# Altium schematic sheet Buttons.SchDoc
size A; SheetNumber: 2; SheetTotal: 4
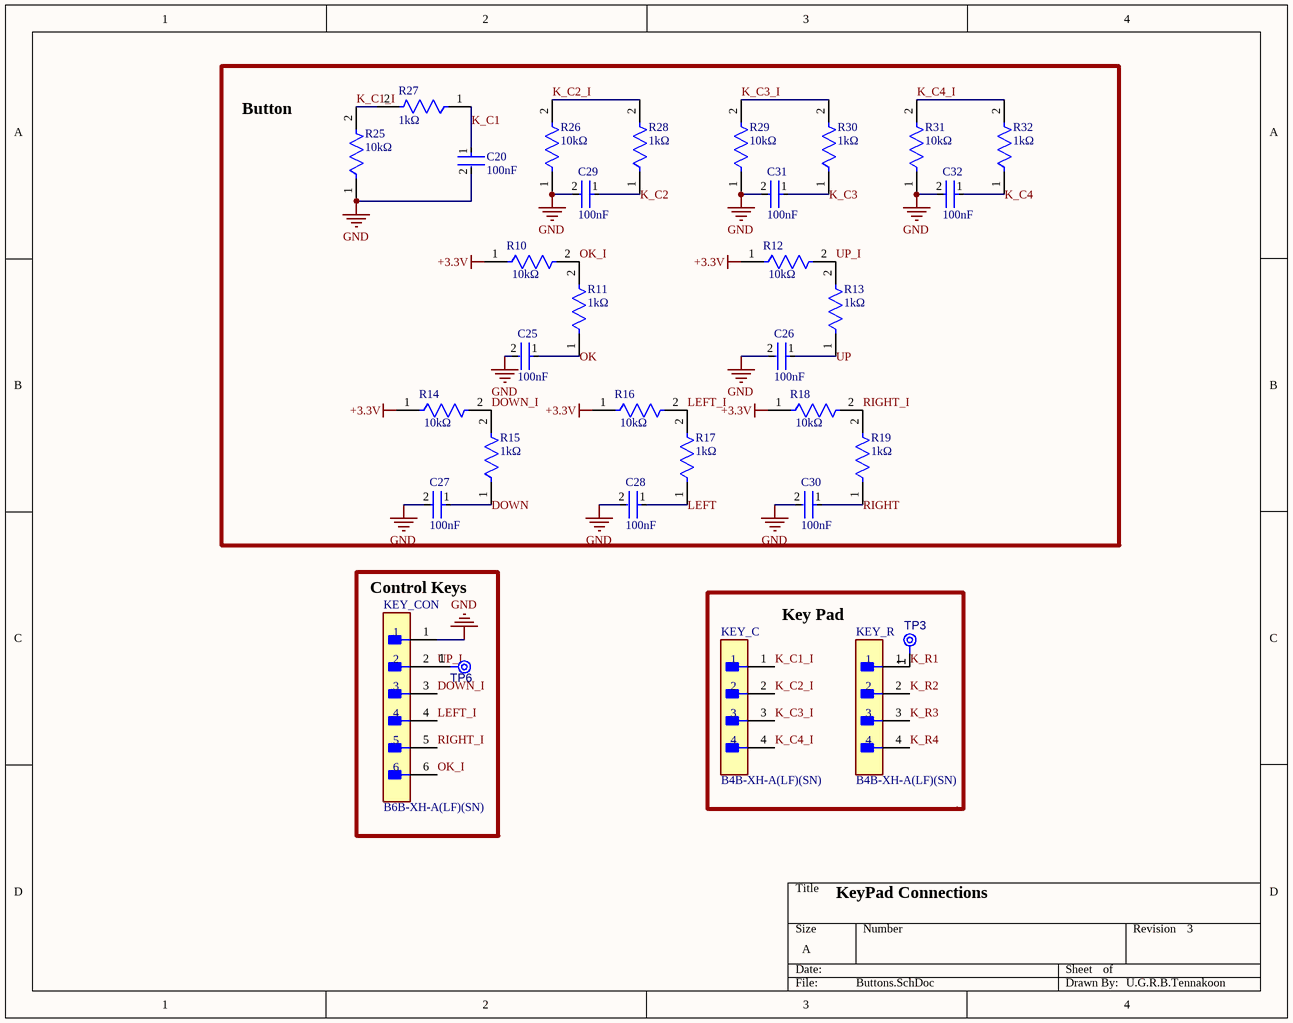
[diagram p0: Buttons.SchDoc]

## Parts
C20  100nF  [FP-CL21-IPC_A]
C25  100nF  [FP-CL21-IPC_A]
C26  100nF  [FP-CL21-IPC_A]
C27  100nF  [FP-CL21-IPC_A]
C28  100nF  [FP-CL21-IPC_A]
C29  100nF  [FP-CL21-IPC_A]
C30  100nF  [FP-CL21-IPC_A]
C31  100nF  [FP-CL21-IPC_A]
C32  100nF  [FP-CL21-IPC_A]
KEY_C  B4B-XH-A(LF)(SN)  [FP-B4B-XH-A_LF_SN-MFG]  (no BOM)
KEY_CON  B6B-XH-A(LF)(SN)  [FP-B6B-XH-A_LF_SN-MFG]  (no BOM)
KEY_R  B4B-XH-A(LF)(SN)  [FP-B4B-XH-A_LF_SN-MFG]  (no BOM)
R10  10kΩ  [FP-SR0805-MFG]
R11  1kΩ  [FP-SR0805-MFG]
R12  10kΩ  [FP-SR0805-MFG]
R13  1kΩ  [FP-SR0805-MFG]
R14  10kΩ  [FP-SR0805-MFG]
R15  1kΩ  [FP-SR0805-MFG]
R16  10kΩ  [FP-SR0805-MFG]
R17  1kΩ  [FP-SR0805-MFG]
R18  10kΩ  [FP-SR0805-MFG]
R19  1kΩ  [FP-SR0805-MFG]
R25  10kΩ  [FP-SR0805-MFG]
R26  10kΩ  [FP-SR0805-MFG]
R27  1kΩ  [FP-SR0805-MFG]
R28  1kΩ  [FP-SR0805-MFG]
R29  10kΩ  [FP-SR0805-MFG]
R30  1kΩ  [FP-SR0805-MFG]
R31  10kΩ  [FP-SR0805-MFG]
R32  1kΩ  [FP-SR0805-MFG]
TP3  TPAD6R  [TP06R]  (value not drawn)  (no BOM)
TP6  TPAD6R  [TP06R]  (value not drawn)  (no BOM)

## Nets
+3.3V: R10.1 R12.1 R14.1 R16.1 R18.1
GND: C20.2 C25.2 C26.2 C27.2 C28.2 C29.2 C30.2 C31.2 C32.2 KEY_CON.1 R25.1 R26.1 R29.1 R31.1
DOWN: C27.1 R15.1
DOWN_I: KEY_CON.3 R14.2 R15.2
K_C1: C20.1 R27.1
K_C1_I: KEY_C.1 R25.2 R27.2
K_C2: C29.1 R28.1
K_C2_I: KEY_C.2 R26.2 R28.2
K_C3: C31.1 R30.1
K_C3_I: KEY_C.3 R29.2 R30.2
K_C4: C32.1 R32.1
K_C4_I: KEY_C.4 R31.2 R32.2
K_R1: KEY_R.1 TP3.1(TP)
K_R2: KEY_R.2
K_R3: KEY_R.3
K_R4: KEY_R.4
LEFT: C28.1 R17.1
LEFT_I: KEY_CON.4 R16.2 R17.2
OK: C25.1 R11.1
OK_I: KEY_CON.6 R10.2 R11.2
RIGHT: C30.1 R19.1
RIGHT_I: KEY_CON.5 R18.2 R19.2
UP: C26.1 R13.1
UP_I: KEY_CON.2 R12.2 R13.2 TP6.1(TP)

## Notes on the sheet
- (near R25) Button
- (near KEY_CON) Control Keys
- Key Pad
- KeyPad Connections
- 3
- U.G.R.B.Tennakoon

## Library data of the parts
C20 C25-C32 = CMP-13271-000177-1: CL21B104KCFWPNE CL21 Series 0805 100nF 100V ±10% Tolerance X7R Multilayer Ceramic Chip Capacitor; Thickness: 0.053inch; Features: Soft Termination; Width: 0.049inch; Min Operating Temperature: -55°C; Ratings: AEC-Q200; Case Code (Imperial): 0805; Mount: Surface Mount; Packaging: Tape and Reel; Case/Package: 0805; Length: 0.079inch; Voltage Rating: 100V; Capacitance: 100nF; Case Code (Metric): 2012; Tolerance: 10%; Max Operating Temperature: 125°C
KEY_C KEY_R = CMP-17439-000250-1: CONN HEADER VERT 4POS 2.5MM; Number of Contacts: 4; Contact Resistance: 20mR; Voltage Rating: 250V; Max Current Rating: 3A; Gender: Male; Wire/Cable Gauge: 22AWG; Mated Stacking Heights: 9.8mm; Insulation Resistance: 1GR; Orientation: Straight; Contact Type: Male Pin; Contact Finish - Mating: TIN; Series: XH; Max Voltage Rating (AC): 250V; Lead Pitch: 2.5mm; Contact Shape: Square; Insulation Color: Natural; Termination: Solder; Lead Free: Lead Free; Voltage Rating (AC): 250V; Number of Rows: 1; Flammability Rating: UL94 V-0; Number of Positions: 4; Max Operating Temperature: 85°C; Package Quantity: 500; Mount: Through Hole; REACH SVHC: No SVHC; Connector Type: Header; Insulation Material: Nylon; Fastening Type: Detent; Min Operating Temperature: -25°C; Housing Color: White; Packaging: Bulk; Contact Plating: Tin; Contact Material: Brass; Max Voltage Rating (DC): 250V; Housing Material: Polyamide; Color: Natural; Material: Polyamide; Pitch: 2.5mm; Depth: 5.75mm; Current Rating: 3A; Length: 12.4mm
KEY_CON = CMP-17439-000076-1: CONN HEADER VERT 6POS 2.5MM
R10 R12 R14 R16 R18 R25 R26 R29 R31 = CMP-03412-005404-1: RES SMD 0805 1/2W 1% 10K OHM; Manufacturer Part Number: SR0805FR-4710KL; Manufacturer: Yageo; Power Rating: 0.5W; Voltage Rating: 150V; Tolerance: 0.01; Automotive Grade: Grade 0; Value: 10KΩ; RoHS: TRUE; Package: SR0805; Temperature: -55°C to +155°C; Composition: Thick Film; Lead Free: Yes; Ipc Land Pattern Name: RESC200125X50; Footprint Url: http://www.yageo.com/exep/pages/download/literatures/PYu-R_Mount_10.pdf; ComponentLink2URL: http://www.yageo.com/documents/recent/PYu-SR_D_F%20tol_RoHS_L_3.pdf; Series: SR; Resistance: 10KΩ; Device Class L3: Chip SMD Resistors; Device Class L2: Resistors; Digikey Description: RES SMD 0805 1/2W 1% 10K OHM; Category: Res; Temperature Range Low: -55°C; ComponentLink2Description: Datasheet; Automotive: Yes; Height: 0.6mm; Octopart: https://octopart.com/sr0805fr-4710kl-yageo-91478094; Device Class L1: Passive Components; Temperature Range High: +155°C
R11 R13 R15 R17 R19 R27 R28 R30 R32 = CMP-03412-005404-1: RMC08051K5%N; Manufacturer Part Number: SR0805FR-4710KL; Manufacturer: Yageo; Value: 10KΩ; Power Rating: 0.5W; Voltage Rating: 150V; Tolerance: 0.01; Automotive Grade: Grade 0; RoHS: TRUE; Package: SR0805; Temperature: -55°C to +155°C; Composition: Thick Film; Lead Free: Yes; Ipc Land Pattern Name: RESC200125X50; Footprint Url: http://www.yageo.com/exep/pages/download/literatures/PYu-R_Mount_10.pdf; ComponentLink2URL: http://www.yageo.com/documents/recent/PYu-SR_D_F%20tol_RoHS_L_3.pdf; Series: SR; Resistance: 10KΩ; Device Class L3: Chip SMD Resistors; Device Class L2: Resistors; Digikey Description: RES SMD 0805 1/2W 1% 10K OHM; Category: Res; Temperature Range Low: -55°C; ComponentLink2Description: Datasheet; Automotive: Yes; Height: 0.6mm; Octopart: https://octopart.com/sr0805fr-4710kl-yageo-91478094; Device Class L1: Passive Components; Temperature Range High: +155°C
TP3 TP6 = CMP-00028-00002-3: 0.6mm round; Pins: 1